# EAGLE schematic V-00793-00 (EAGLE 7.2.0)
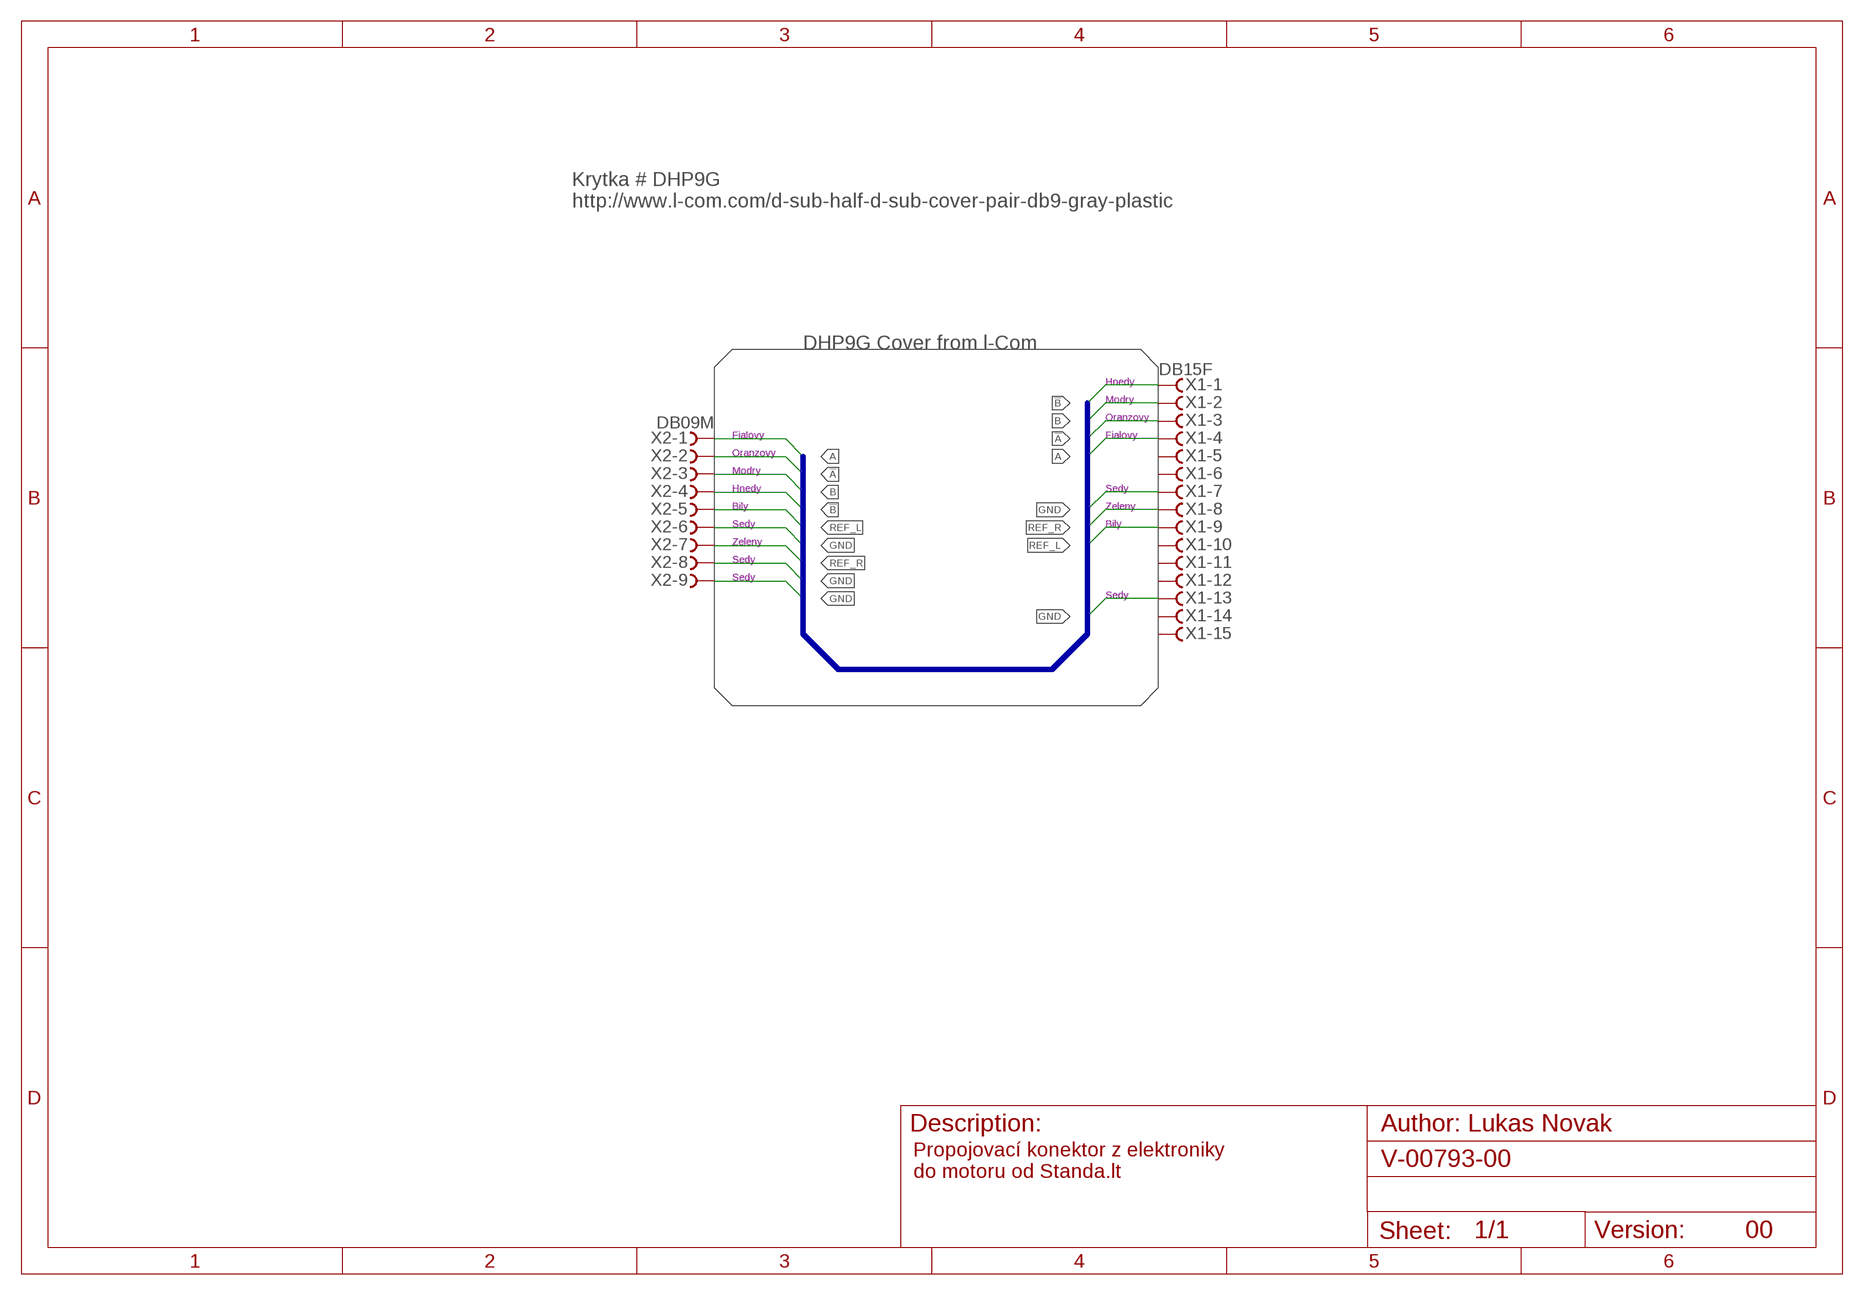
[diagram p0: schematic, sheet 1]

## Parts
X1  DB15F  D-SUB15-HDR15RA  [HDR15RA]
X2  DB09M  D-SUB9-H5M09RA  [H5M09RA]

## Nets
!A: X1.3 X2.2
!B: X1.1 X2.4
A: X1.4 X2.1
B: X1.2 X2.3
GND: X1.7 X1.13 X2.6 X2.8 X2.9
REF_L: X1.9 X2.5
REF_R: X1.8 X2.7
Unconnected: X1.5 X1.6 X1.10 X1.11 X1.12 X1.14 X1.15

## Buses
A,!A,B,!B,REF_L,REF_R,GND

## Notes on the sheet
- Krytka # DHP9G
  http://www.l-com.com/d-sub-half-d-sub-cover-pair-db9-gray-plastic
- DHP9G Cover from l-Com
- Hnedy
- Modry
- Oranzovy
- Fialovy | Fialovy
- Oranzovy
- Modry
- Hnedy | Sedy
- Bily | Zeleny
- Sedy | Bily
- Zeleny
- Sedy
- Sedy
- Sedy
- Propojovací konektor z elektroniky
  do motoru od Standa.lt
- 00

## Library data of the parts
X1 = con-thomas-betts:D-SUB15-: D-Subminiatur Connector Source: Electronioc Interconnects European Edition 1998; OC_FARNELL: unknown; OC_NEWARK: unknown
X2 = con-thomas-betts:D-SUB9-: D-Subminiatur Connector Source: Electronioc Interconnects European Edition 1998; OC_FARNELL: unknown; OC_NEWARK: unknown